# Altium schematic sheet 05_02_Truth_Tables.SchDoc
size 111 x 66 mm
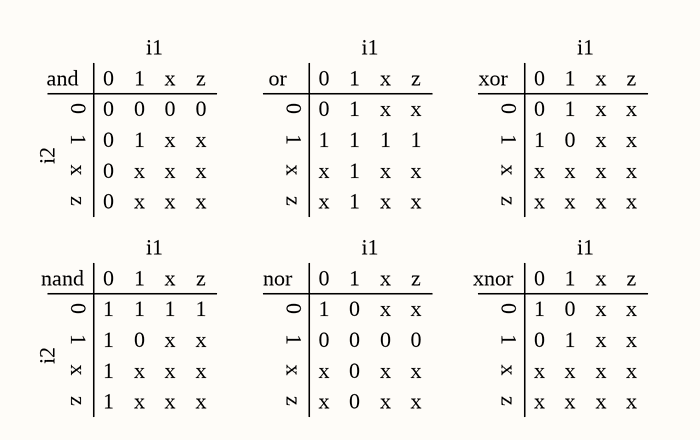
[diagram p0: 05_02_Truth_Tables.SchDoc]

## Notes on the sheet
- and
- 0
- 1
- i1
- x
- z
- or
- xor
- i2
- nand
- nor
- xnor